# EAGLE design ecmeter (EAGLE 6.5.0)
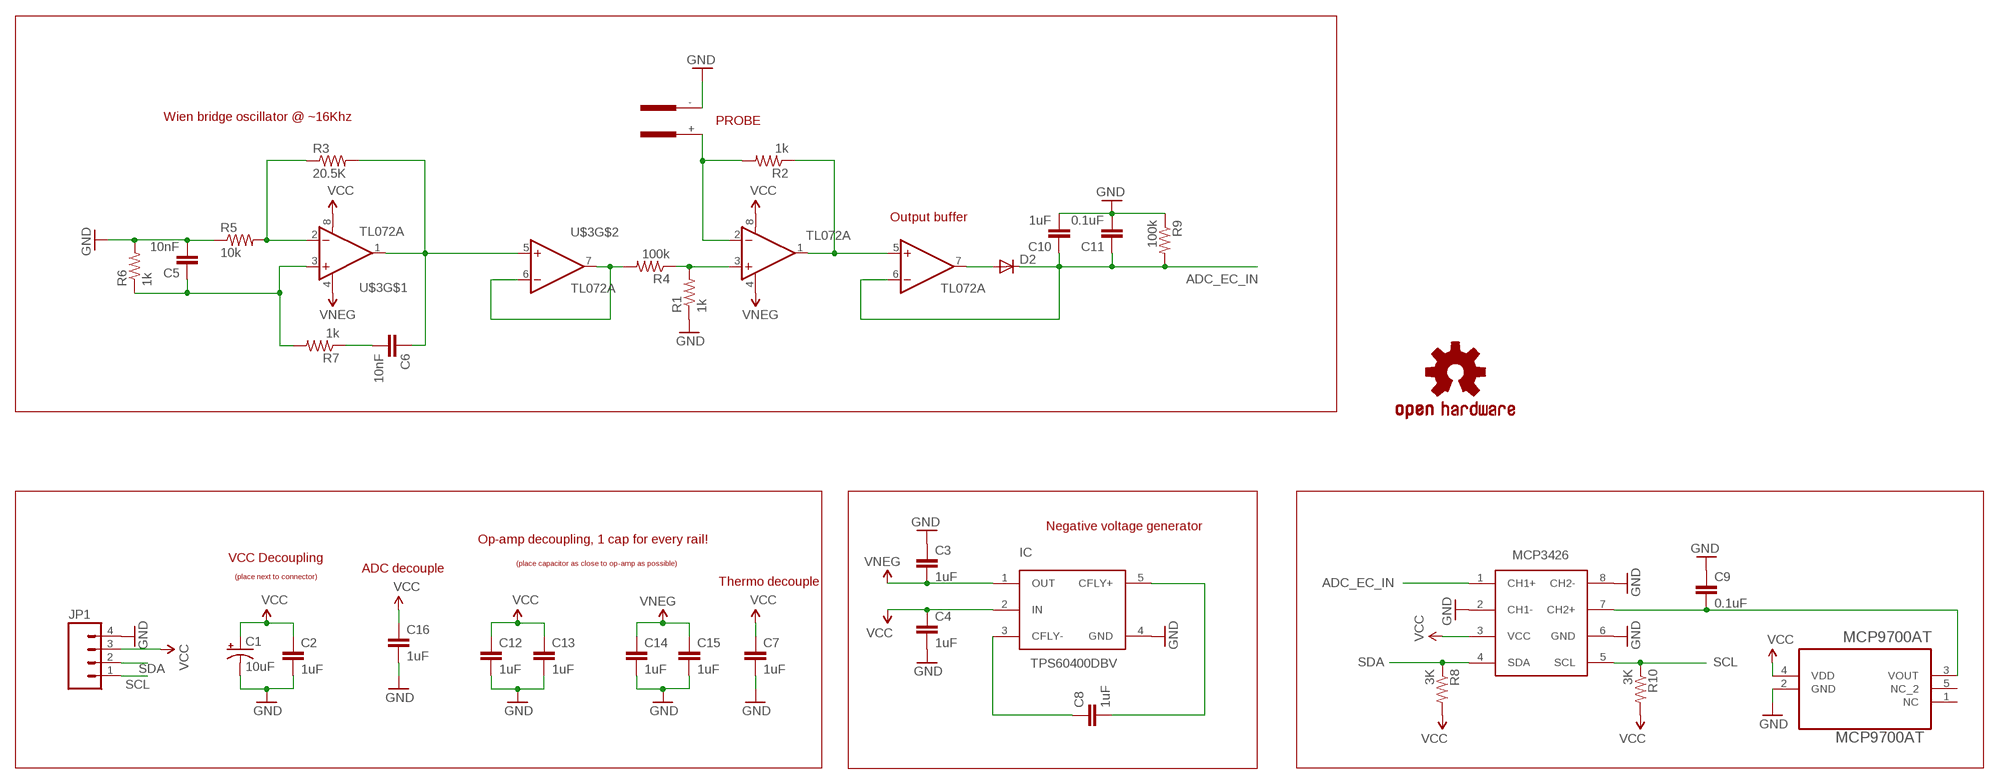
[diagram p0: schematic, sheet 1]

## Parts
C1  10uF  10UF-TANT  [EIA3216]
C2  1uF  CAP0805  [0805]
C3  1uF  CAP0805  [0805]
C4  1uF  CAP0805  [0805]
C5  10nF  CAP0603-CAP  [0603-CAP]
C6  10nF  CAP0603-CAP  [0603-CAP]
C7  1uF  CAP0805  [0805]
C8  1uF  CAP0805  [0805]
C9  0.1uF  CAP0805  [0805]
C10  1uF  CAP0805  [0805]
C11  0.1uF  CAP0805  [0805]
C12  1uF  CAP0805  [0805]
C13  1uF  CAP0805  [0805]
C14  1uF  CAP0805  [0805]
C15  1uF  CAP0805  [0805]
C16  1uF  CAP0805  [0805]
D2  DIODESOD  [SOD-323]
IC  TPS60400DBV  [SOT23-5]
JP1  M04POLAR  [MOLEX-1X4]
LOGO1  OSHW-LOGOM  [OSHW-LOGO-M]
MCP9700AT  MCP9700AT  MCP9700AT-E/LT  [SOT65P210X110-5N]
R1  1k  1K-1%  [0603-RES]
R2  1k  1K-1%  [0603-RES]
R3  20.5K  22KOHM1/10W1%(0603)  [0603-RES]
R4  100k  1K-1%  [0603-RES]
R5  10k  10K-1%RES-00824  [0603-RES]
R6  1k  1K-1%  [0603-RES]
R7  1k  1K-1%  [0603-RES]
R8  3K  10K-1%RES-00824  [0603-RES]
R9  100k  10K-1%RES-00824  [0603-RES]
R10  3K  10K-1%RES-00824  [0603-RES]
U$1  TL072A  [SOIC8]
U$2  K1-PROBE  [K1-PROBE]
U$3  TL072A  [SOIC8]
U$4  MCP3426  [SOIC8]

## Nets
ADC_EC_IN: C10.1 C11.1 D2.1(C) R9.2 U$1.6(-IN) U$4.1(CH1+)
GND: C1.C(-) C2.2 C3.1 C4.2 C5.2 C7.2 C9.1 C10.2 C11.2 C12.2 C13.2 C14.2 C15.2 C16.2 IC.4(GND) JP1.4 MCP9700AT.2(GND) R1.1 R5.1 R6.2 R9.1 U$2.- U$4.2(CH1-) U$4.6(GND) U$4.8(CH2-)
N$1: C6.1 R3.2 U$3.1(OUT) U$3.5(+IN)
N$2: R3.1 R5.2 U$3.2(-IN)
N$3: C5.1 R6.1 R7.2 U$3.3(+IN)
N$4: C6.2 R7.1
N$5: R4.2 U$3.6(-IN) U$3.7(OUT)
N$6: R1.2 R4.1 U$1.3(+IN)
N$8: R2.1 U$1.1(OUT) U$1.5(+IN)
N$9: R2.2 U$1.2(-IN) U$2.+
N$10: D2.2(A) U$1.7(OUT)
N$13: C8.2 IC.5(CFLY+)
N$14: C8.1 IC.3(CFLY-)
N$46: C9.2 MCP9700AT.3(VOUT) U$4.7(CH2+)
SCL: JP1.1 R10.1 U$4.5(SCL)
SDA: JP1.2 R8.1 U$4.4(SDA)
VCC: C1.A(+) C2.1 C4.1 C7.1 C12.1 C13.1 C16.1 IC.2(IN) JP1.3 MCP9700AT.4(VDD) R8.2 R10.2 U$1.8(V+) U$3.8(V+) U$4.3(VCC)
VNEG: C3.2 C14.1 C15.1 IC.1(OUT) U$1.4(V-) U$3.4(V-)
Unconnected: MCP9700AT.1(NC) MCP9700AT.5(NC_2)

## Notes on the sheet
- Wien bridge oscillator @ ~16Khz
- PROBE
- Output buffer
- Negative voltage generator
- Op-amp decoupling, 1 cap for every rail!
- VCC Decoupling
- (place capacitor as close to op-amp as possible)
- ADC decouple
- (place next to connector)
- Thermo decouple

## Library data of the parts
C1 = SparkFun-Capacitors:10UF-TANT: 10uF Tantalum SMT CAP-00811- 16V 10% (EIA-3216); PROD_ID: CAP-00811
C2-C16 = SparkFun-Capacitors:CAP: Capacitor Standard 0603 ceramic capacitor, and 0.1" leaded capacitor.
D2 = SparkFun-DiscreteSemi:DIODE: Diode These are standard reverse protection diodes and small signal diodes. SMA package can handle up to about 1A. SOD-323 can handle about 200mA. What the SOD-323 package when ordering, there are some mfgs out there that are 5-pin packages.; PROD_ID: DIO-09646
IC = benkyo:TPS60400DBV
JP1 = SparkFun-Connectors:M04: Header 4 Standard 4-pin 0.1" header. Use with straight break away headers (SKU : PRT-00116), right angle break away headers (PRT-00553), swiss pins (PRT-00743), machine pins (PRT-00117), and female headers (PRT-00115). Molex polarized connector foot print use with SKU : PRT-08231 with associated crimp pins and housings. 1MM SMD Version SKU: PRT-10208
LOGO1 = SparkFun-Aesthetics:OSHW-LOGO: Open Source Hardware Logo This logo indicates the piece of hardware it is found on incorporates a OSHW license and/or adheres to the definition of open source hardware found here: http://freedomdefined.org/OSHW
MCP9700AT = benkyo:MCP9700AT-E/LT: IC, TEMP SNSR, ±1°C; MPN: MCP9700AT-E/LT; OC_FARNELL: 1332165; OC_NEWARK: 84R6272; PACKAGE: SC70-5; SUPPLIER: Microchip
R1 R2 R6 R7 = SparkFun-Resistors:1K-1%: 1k-ohm SMT 1/10W - 1% (0603) RES-07856; PROD_ID: RES-07856
R3 = SparkFun-Resistors:22KOHM1/10W1%(0603): RES-07853; PROD_ID: RES-07853; VALUE: 22K
R4 = SparkFun-Resistors:1K-1%: 1k-ohm SMT 1/10W - 1% (0603) RES-07856; PROD_ID: RES-07856; VALUE: 1k
R5 = SparkFun-Resistors:10K-1%: 10k-ohm SMT 1/10W - 1% (0603) RES-00824; PROD_ID: RES-00824
R8-R10 = SparkFun-Resistors:10K-1%: 10k-ohm SMT 1/10W - 1% (0603) RES-00824; PROD_ID: RES-00824; VALUE: 10k
U$1 U$3 = benkyo:TL072A
U$2 = benkyo:K1-PROBE
U$4 = benkyo:MCP3426

## Board
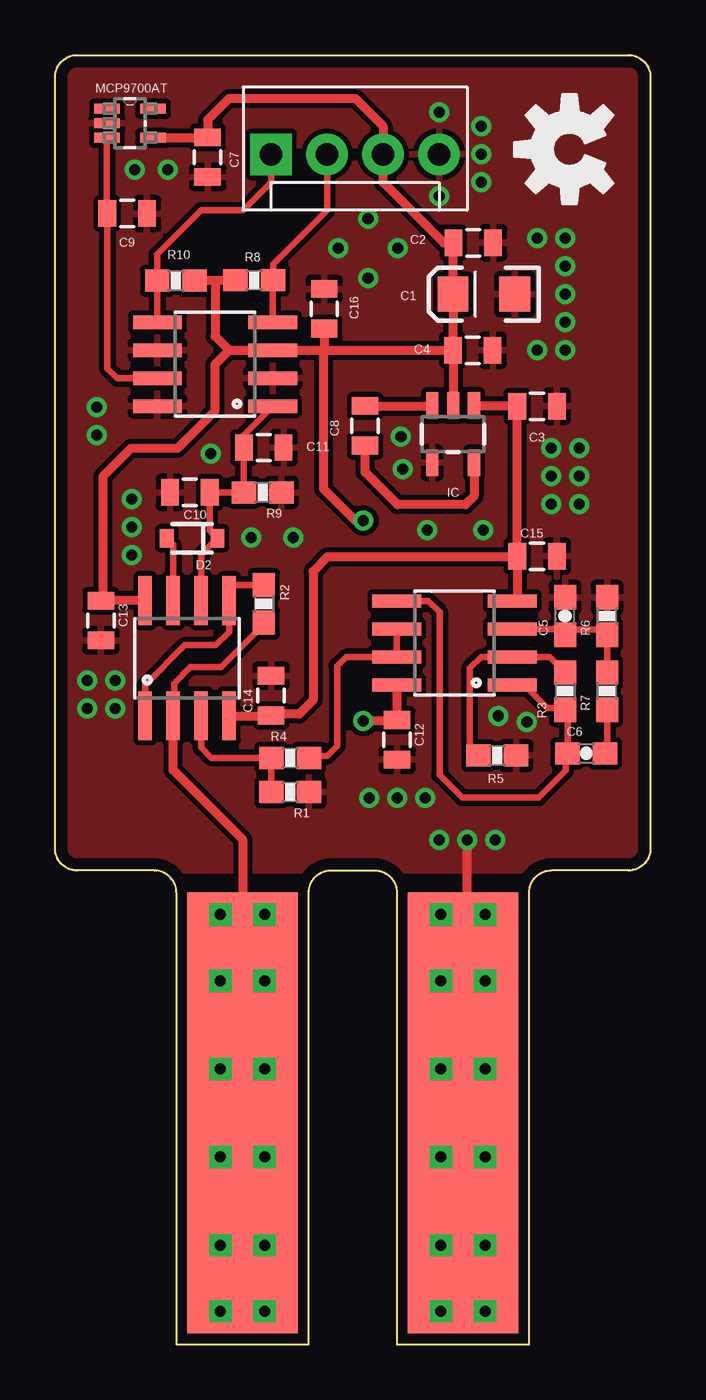
[diagram p1: board, top side]
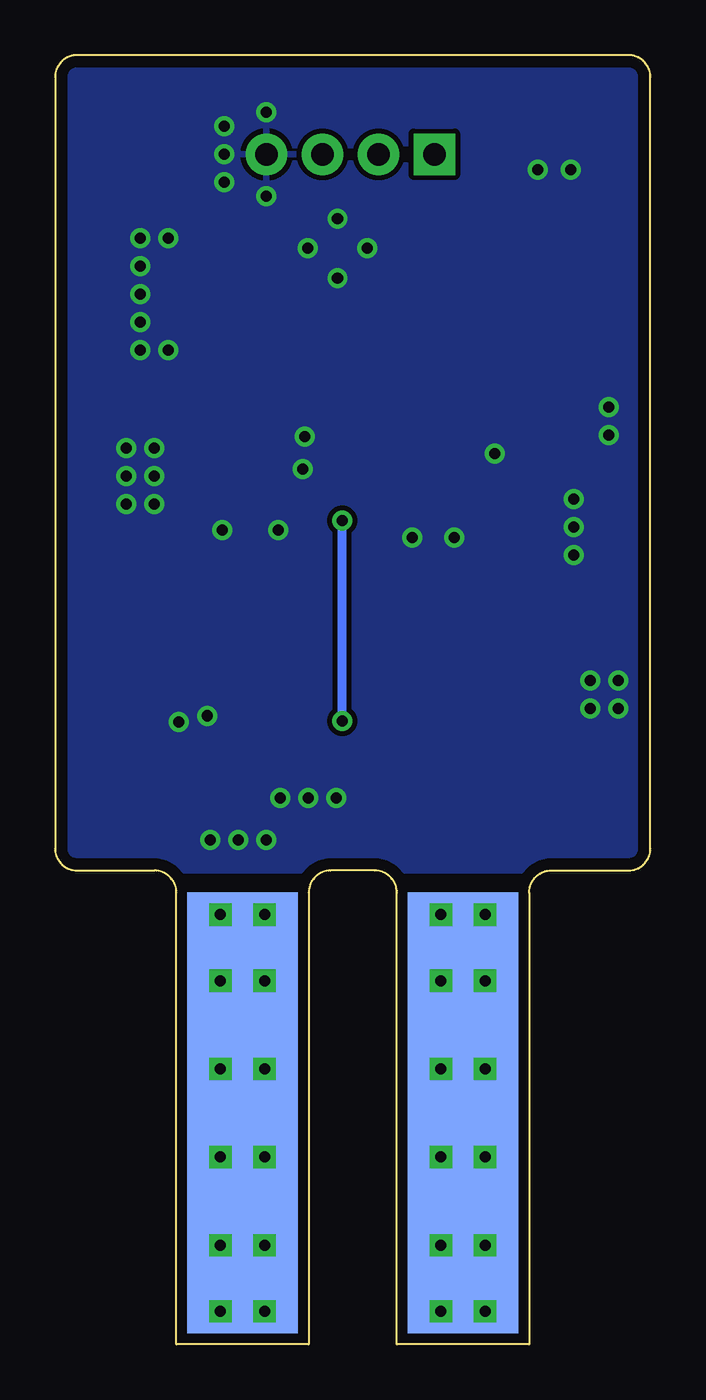
[diagram p2: board, bottom side, seen from below]

Size 27 x 58.5 mm. Coordinates in mm from the lower left corner, seen from the top.
Outline: 5.5,20.5 5.5,0 11.5,0 11.5,20.5 arc-90 12.5,21.5 14.5,21.5 arc-90 15.5,20.5 15.5,0 21.5,0 21.5,20.5 arc-90 22.5,21.5 26,21.5 arc90 27,22.5 27,57.5 arc90 26,58.5 1,58.5 arc90 0,57.5 0,22.5 arc90 1,21.5 4.5,21.5 arc-90 5.5,20.5
Copper layers (1*16): Top 0.035mm / dielectric 1.5mm / Bottom 0.035mm
Design rules "default *": minimum track width 10mil, minimum drill 24mil, track to track 9mil, track to pad 9mil, pad to pad 9mil, via to via 9mil, smd to smd 9mil, copper to edge 20mil, drill to drill 8mil, minimum pad ring 10mil, minimum via ring 8mil, stop-mask expansion 4mil, vias tented up to drill 20mil, thermal gap 10mil

### Footprints (pad centres in the part's own frame; a part is rotated, then mirrored left to right if it is on the bottom)
EIA3216 = smd 1.4 x 1.6: A 1.4,0; C -1.4,0
0805 = smd 0.8 x 1.2: 1 -0.9,0; 2 0.9,0
0603-CAP = smd 1.1 x 1: 1 -0.85,0; 2 0.85,0
SOD-323 = smd 0.63 x 0.83: 1 -1.15,0; 2 1.15,0
SOT23-5 = smd 0.55 x 1.2: 1 -0.95,-1.3; 2 0,-1.3; 3 0.95,-1.3; 4 0.95,1.3; 5 -0.95,1.3
MOLEX-1X4 = drill 1.016 pad 1.88 square: 1 0,0 | drill 1.016 pad 1.88: 2 2.54,0; 3 5.08,0; 4 7.62,0
SOT65P210X110-5N = smd 1.168 x 0.457: 1 -1.041,0.66; 2 -1.041,0; 3 -1.041,-0.66; 4 1.041,-0.66; 5 1.041,0.66
0603-RES = smd 1.1 x 1: 1 -0.85,0; 2 0.85,0
SOIC8 = smd 0.61 x 2.21: 1 -1.905,-2.616; 2 -0.635,-2.616; 3 0.635,-2.616; 4 1.905,-2.616; 5 1.905,2.616; 6 0.635,2.616; 7 -0.635,2.616; 8 -1.905,2.616
K1-PROBE = smd 5 x 20: + -5,0; - 5,0 | drill 0.5 square: P$1 -6,-9; P$2 -4,-9; P$5 4,-9; P$6 6,-9; P$7 -6,9; P$8 -4,9; P$9 4,9; P$10 6,9; P$11 4,6; P$12 6,6; P$13 4,2; P$14 6,2; P$15 4,-2; P$16 6,-2; P$17 4,-6; P$18 6,-6; P$19 -6,-6; P$20 -4,-6; P$21 -6,-2; P$22 -4,-2; P$23 -6,2; P$24 -4,2; P$25 -6,6; P$26 -4,6 | smd 5 x 20 bottom: P$3 -5,0; P$4 5,0

### Placement (x,y rotation side)
C1  19.45,47.65 180 top
C2  18.96,49.99 0 top
C3  21.86,42.57 180 top
C4  18.94,45.11 0 top
C5  23.13,33.05 90 top
C6  24.1,26.82 0 top
C7  6.92,53.87 270 top
C8  14.06,41.68 270 top
C9  3.27,51.32 180 top
C10  6.11,38.66 180 top
C11  9.46,40.69 0 top
C12  15.51,27.43 270 top
C13  2.07,32.84 270 top
C14  9.79,29.44 90 top
C15  21.86,35.76 0 top
C16  12.21,46.99 90 top
D2  6.21,36.58 180 top
IC  18.05,41.3 180 top
JP1  9.79,54 0 top
LOGO1  23.33,54.23 90 top
MCP9700AT  3.39,55.41 0 top
R1  10.66,25.06 180 top
R2  9.46,33.6 270 top
R3  23.13,29.64 270 top
R4  10.66,26.61 0 top
R5  20.06,26.72 180 top
R6  25.04,33.05 90 top
R7  25.04,29.64 90 top
R8  9.03,48.28 180 top
R9  9.41,38.66 180 top
R10  5.48,48.26 0 top
U$1  5.99,31.14 0 top
U$2  13.5,10.5 0 top
U$3  18.11,31.82 90 top
U$4  7.26,44.48 90 top

### Tracks (layer width: path | path; a pad name or v marks a point on that pad's centre or on a via)
ADC_EC_IN
  Top 0.305: U$1.6 6.62,35.83 D2.1 7.01,36.93 C10.1 R9.2 C11.1 8.56,41.26 U$4.1
GND  (via drill 0.5)
  Top 0.406: U$2.- 18.68,10.68 v18.68,22.88
  other vias: 15.69,41.2 15.76,39.73 20.11,28.52 21.4,28.24 19.32,55.27 19.32,54 19.32,52.73 23.13,50.19 23.13,48.92 23.13,47.65 23.13,46.38 23.13,45.11 17.41,52.09 17.41,55.91 21.86,50.19 21.86,45.11 23.77,38.12 23.77,39.4 23.77,40.66 22.5,40.66 22.5,39.4 22.5,38.12 3.61,53.3 5.11,53.3 3.47,35.81 3.47,37.08 3.47,38.35 16.88,36.96 19.42,36.96 8.91,36.6 10.81,36.6 1.9,42.52 1.9,41.25 1.46,30.12 2.73,30.12 2.73,28.85 1.46,28.85 14.24,24.79 15.51,24.79 16.78,24.79 17.41,22.88 19.95,22.88 7.05,40.41 14.19,51.08 15.54,49.73 14.19,48.39 12.84,49.73
  pour Top: -2,58.5 29,58.5 29,21.5 -2,21.5
  pour Bottom: -2,58.5 29,58.5 29,21.5 -2,21.5
N$1
  Top 0.305: U$3.1 21.28,29.92 22.32,28.88 23.04,28.88 R3.2 23.25,28.68 C6.1 23.16,27.06 23.16,26.03 21.94,24.81 18.46,24.81 17.44,25.83 17.44,33.22 16.93,33.73 U$3.5
N$2
  Top 0.305: R3.1 22.43,31.19 U$3.2 19.32,31.19 18.81,30.68 18.81,27.22 R5.2
N$3
  Top 0.305: U$3.3 22.87,32.46 arc-90 C5.1 23.37,32.44 24.58,32.44 24.82,32.2 R6.1 R7.2
N$4
  Top 0.305: R7.1 25.04,27.33 24.95,27.24 C6.2
N$5
  Top 0.305: U$3.6 U$3.7 13.2,31.19 12.79,30.78 12.79,27.15 12.34,26.7 11.6,26.7 R4.2
N$6
  Top 0.305: U$1.3 6.62,27.08 7.09,26.61 R4.1 R1.2
N$8
  Top 0.305: U$1.1 4.08,29.92 5.88,31.72 7.28,31.72 7.89,32.33 U$1.5 7.89,34.31 8.03,34.45 R2.1
N$9
  Top 0.305: R2.2 9.5,32.7 7.53,30.73 6.14,30.73 5.4,30 5.4,28.58 U$1.2
  Top 0.406: U$2.+ 8.53,10.52 8.53,22.88 5.35,26.06 U$1.2
N$10
  Top 0.305: D2.2 5.35,36.29 U$1.7
N$13
  Top 0.406: IC.5 19,38.49 18.61,38.1 15.54,38.1 14.06,39.57 C8.2
N$14
  Top 0.406: C8.1 17.08,42.58 IC.3
N$46
  Top 0.305: U$4.7 2.81,43.84 2.37,44.28 C9.2 2.35,51.83 MCP9700AT.3
SCL
  Top 0.305: U$4.5 4.63,46.39 R10.1 4.63,49.47 6.62,51.46 8.53,51.46 9.79,52.73 JP1.1
SDA
  Top 0.305: U$4.4 R8.1 9.88,49.01 12.34,51.46 JP1.2
VCC  (via drill 0.5)
  Top 0.406: C4.1 C1.A 18.05,49.97 C2.1 17.62,49.99 14.88,52.73 JP1.3 14.88,55.27 13.61,56.54 7.89,56.54 6.92,55.57 C7.1 7.07,54.75 MCP9700AT.4 | C4.1 IC.2 | 18.02,45.12 C4.1 | 12.18,45.11 U$4.3 7.89,45.11 | 12.18,45.11 12.34,45.11 | 12.34,45.11 C4.1 | C16.1 12.21,45.24 12.34,45.11 | R8.2 8.16,48.26 7.26,48.26 | 7.26,48.26 R10.2 | 7.26,48.26 7.26,45.74 7.89,45.11 | C13.1 2.19,33.76 U$1.8 2.25,33.76 2.17,33.68 2.17,39.4 3.45,40.66 5.55,40.66 7.26,42.37 7.26,44.48 7.89,45.11 | C12.1 15.5,28.34 U$3.8 15.5,28.35 15.54,28.35 15.54,28.3 v13.99,28.3 | 12.18,45.11 12.18,38.81 13.61,37.39 v13.99,37.39
  Bottom 0.406: v13.99,28.3 v13.99,37.39
VNEG
  Top 0.406: IC.1 20.93,42.6 C3.2 | C3.2 | U$1.4 9.78,28.52 C14.1 9.86,28.6 11.06,28.6 11.7,29.23 11.7,35.08 12.36,35.74 20.93,35.74 C15.1 | C15.1 20.96,33.96 U$3.4 | C15.1 C3.2 | 20.86,35.66 C15.1